# Altium schematic sheet Sheet2.SchDoc
size A; SheetNumber: 1; SheetTotal: 1
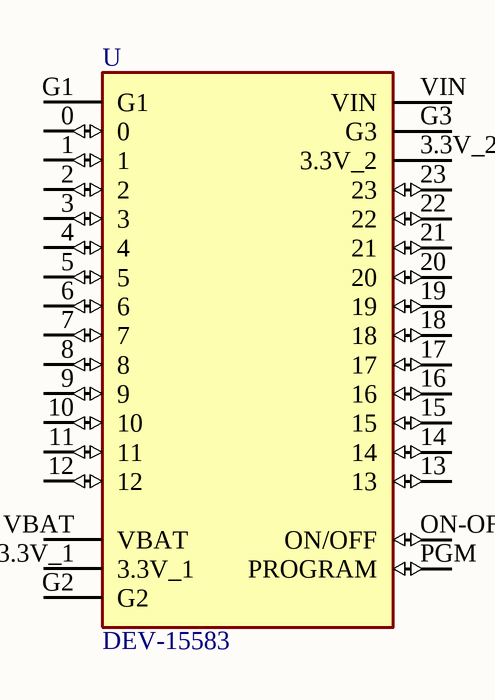
[diagram p0: Sheet2.SchDoc]

## Parts
U  DEV-15583  [MODULE_DEV-15583]

## Nets

Not connected (* = marked no-connect by the designer): U 0 1 2 3 3.3V_1 3.3V_2 4 5 6 7 8 9 10 11 12 13 14 15 16 17 18 19 20 21 22 23 G1 G2 G3 ON-OFF(ON/OFF) PGM(PROGRAM) VBAT VIN

## Library data of the parts
U = DEV-15583: RT1062 Teensy 4.0 i.MX ARMÂ® CortexÂ®-M7 MPU Embedded Evaluation Board; MF: SparkFun Electronics; Value: *; Package: None; Digi-Key_Part_Number: 1568-DEV-15583-ND; Digi-Key_Purchase_URL: https://www.digikey.com/product-detail/en/sparkfun-electronics/DEV-15583/1568-DEV-15583-ND/10384551?utm_source=snapeda&utm_medium=aggregator&utm_campaign=symbol; MP: DEV-15583; SnapEDA_Link: https://www.snapeda.com/parts/DEV-15583/SparkFun%20Electronics/view-part/4001229/?ref=snap